# EAGLE design VEML6070-Breakout_v10 (EAGLE 7.5.0)
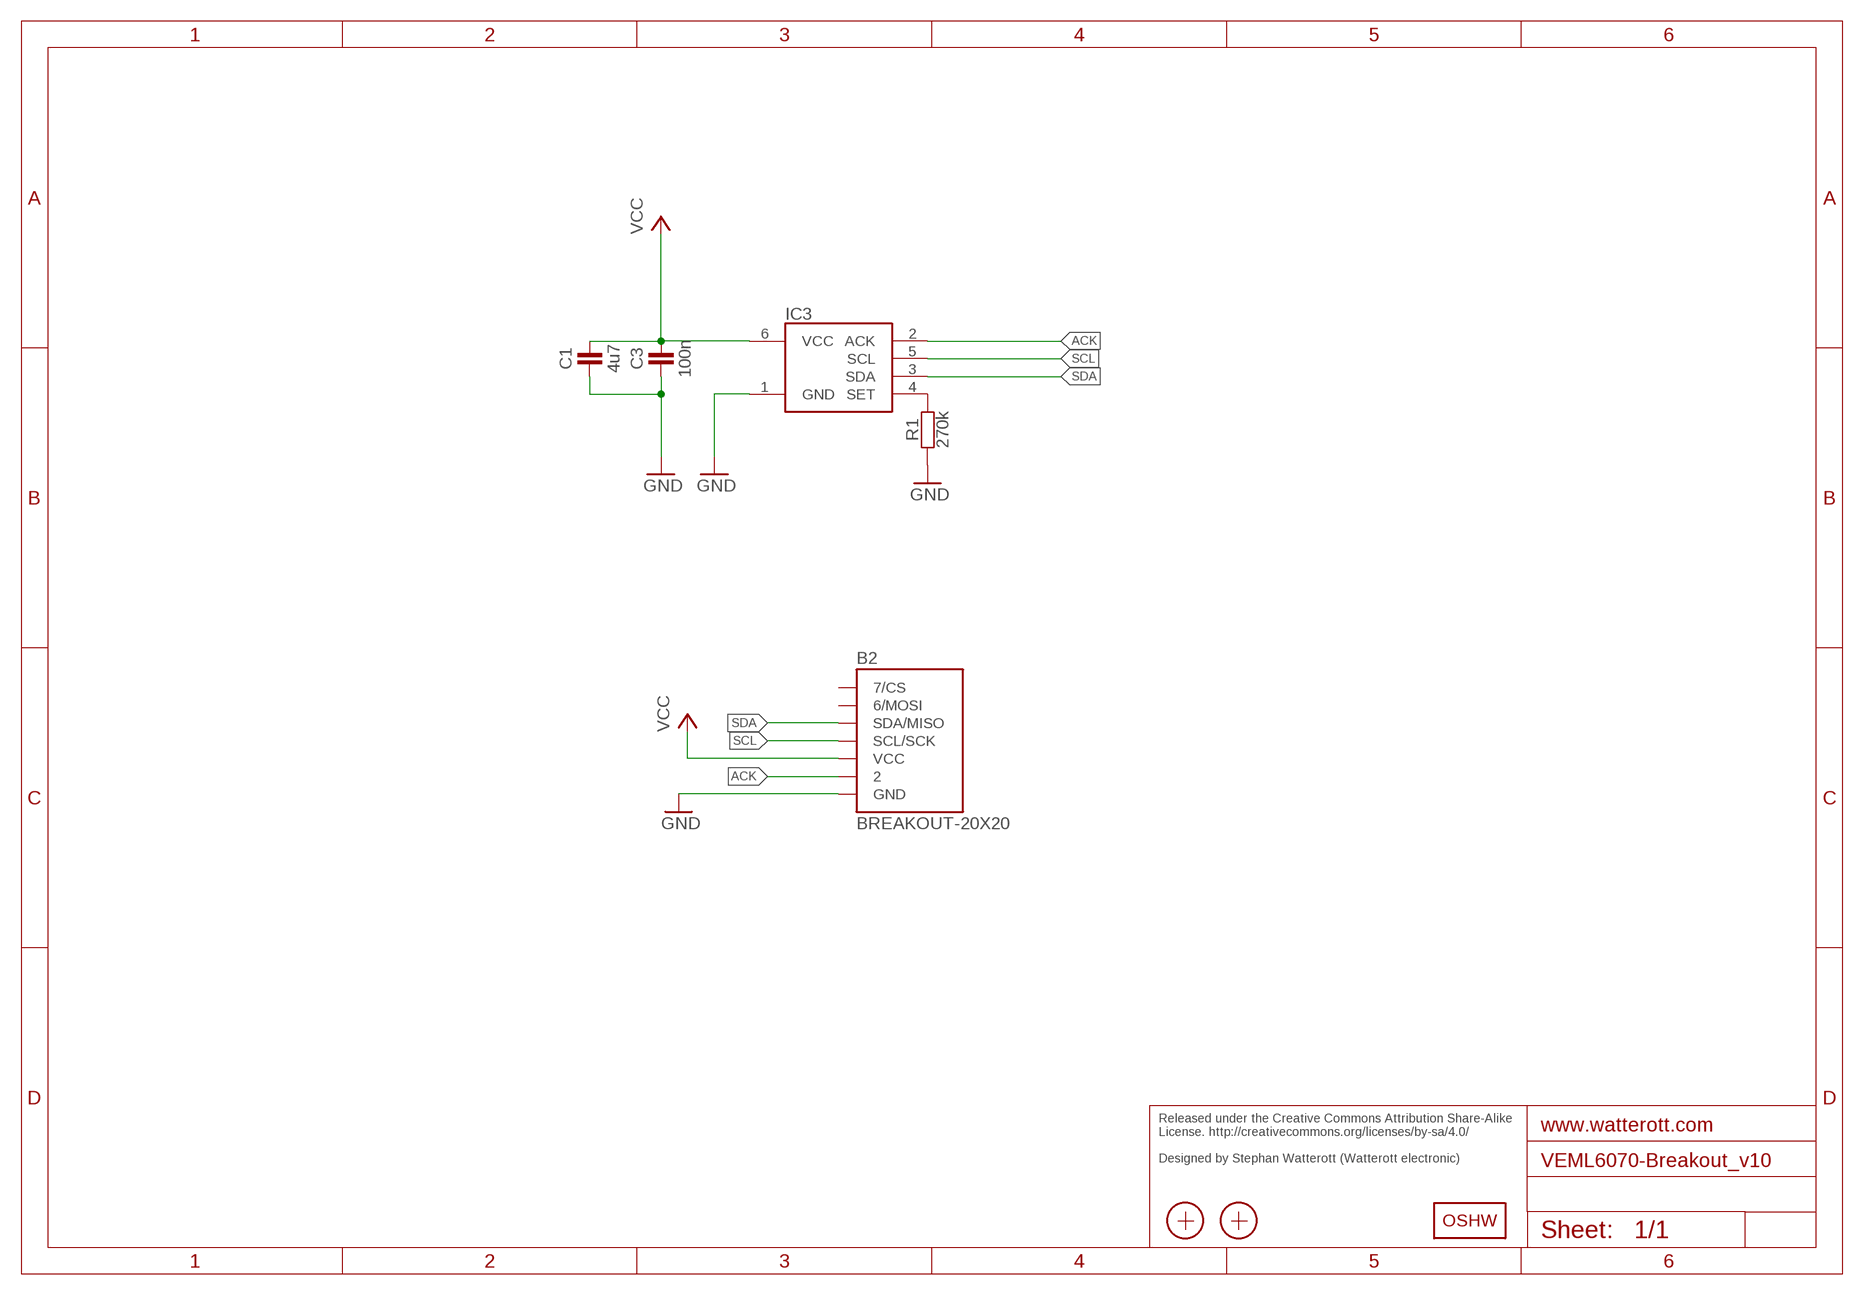
[diagram p0: schematic, sheet 1]

## Parts
B2  BREAKOUT-20X20  [BREAKOUT-20X20]
C1  4u7  CAPACITOR-C0402  [R0402]
C3  100n  CAPACITOR-C0402  [R0402]
IC3  VEML6070  [OPLGA]
LOGO2  OSHW_LOGOX0070  [OSHW_6X70]
R1  270k  RESISTOR-R0402  [R0402]
X1  PASSER-07  [PASSER_07MM]
X2  PASSER-07  [PASSER_07MM]

## Nets
ACK: B2.2 IC3.2(ACK)
GND: B2.GND C1.1 C3.1 IC3.1(GND) R1.1
N$1: IC3.4(SET) R1.2
SCL: B2.SCL/SCK IC3.5(SCL)
SDA: B2.SDA/MISO IC3.3(SDA)
VCC: B2.VCC C1.2 C3.2 IC3.6(VCC)
Unconnected: B2.CS(7/CS) B2.MOSI(6/MOSI)

## Notes on the sheet
- Released under the Creative Commons Attribution Share-Alike 
  License. http://creativecommons.org/licenses/by-sa/4.0/
  
  Designed by Stephan Watterott (Watterott electronic)

## Library data of the parts
B2 = we-board:BREAKOUT: Breakout Template
C1 C3 = we-rcl:CAPACITOR: Capacitors ...4.7uF @ 6.3V -> 0402 ...10uF @ 16V -> 0603 ...22uF @ 25V -> 0805
IC3 = we-sensor:VEML6070: UV Light Sensor with I2C Interface - VEML6070 is an advanced ultraviolet (UV) light sensor with I2C protocol interface and designed by the CMOS process.
LOGO2 = we-symbol:OSHW_LOGO: Open-Source-Hardware Logo
R1 = we-rcl:RESISTOR: Resistors all kinds in 0603 and 0402
X1 X2 = we-symbol:PASSER: Fiducial Markers

## Board
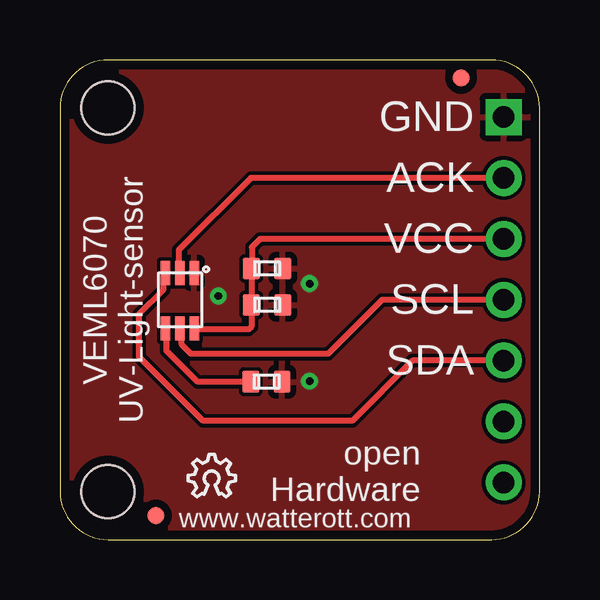
[diagram p1: board, top side]
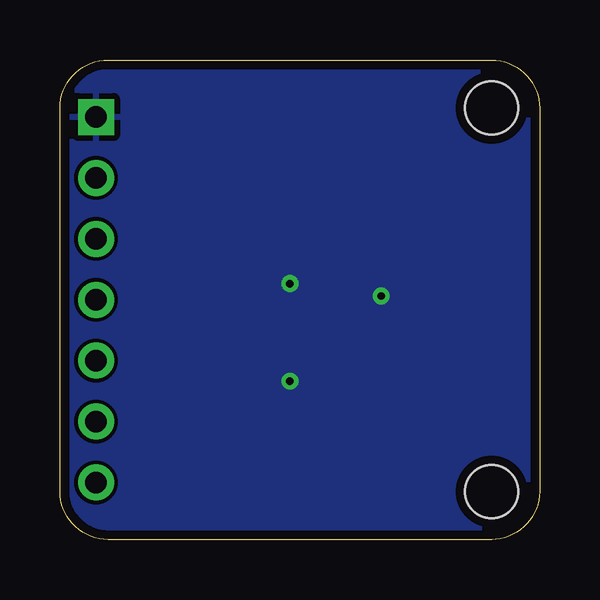
[diagram p2: board, bottom side, seen from below]

Size 20 x 20 mm. Coordinates in mm from the lower left corner, seen from the top.
Copper layers (1*16): Top 0.035mm / dielectric 1.5mm / Bottom 0.035mm
Design rules "default *": minimum track width 6mil, minimum drill 0.296mm, track to track 6mil, track to pad 6mil, pad to pad 6mil, via to via 6mil, smd to smd 1mil, copper to edge 15mil, drill to drill 8mil, minimum pad ring 10mil, minimum via ring 8mil, stop-mask expansion 4mil, vias tented up to drill 0.7mm, thermal gap 10mil

### Footprints (pad centres in the part's own frame; a part is rotated, then mirrored left to right if it is on the bottom)
BREAKOUT-20X20 = drill 0.9 pad 1.5: 2 18.5,15.08; CS 18.5,2.38; MOSI 18.5,4.92; SCL/SCK 18.5,10; SDA/MISO 18.5,7.46; VCC 18.5,12.54 | drill 0.9 pad 1.5 square: GND 18.5,17.62 | hole 2.2: 2,18; 2,2
R0402 = smd 0.9 x 0.7: 1 0,0.65; 2 0,-0.65
OPLGA = smd 1 x 0.4: 1 -1.12,0.6; 2 -1.12,0; 3 -1.12,-0.6; 4 1.2,-0.6; 5 1.2,0; 6 1.2,0.6
PASSER_07MM = smd 0.7 x 0.7: X 0,0

### Placement (x,y rotation side)
B2  0,0 0 top
C1  8.64,9.78 270 top
C3  8.64,11.3 270 top
IC3  5,10 270 top
LOGO2  5.33,1.78 0 top
R1  8.61,6.58 270 top
X1  16.73,19.25 0 top
X2  4,1 0 top

### Tracks (layer width: path | path; a pad name or v marks a point on that pad's centre or on a via)
ACK
  Top 0.254: B2.2 7.97,15.08 4.95,12.06 4.95,11.17 IC3.2
GND  (via drill 0.3)
  other vias: 6.6,10.16 10.41,10.67 10.41,6.6
  pour Top: 0,20 20,20 20,0 0,0
  pour Bottom: 0,20 20,20 20,0 0,0
N$1
  Top 0.254: R1.2 5.74,6.58 4.45,7.87 4.45,8.76 IC3.4
SCL
  Top 0.254: B2.SCL/SCK 13.43,10 11.18,7.75 5.46,7.75 5.08,8.13 5.08,8.72 IC3.5
SDA
  Top 0.254: B2.SDA/MISO 14.7,7.46 12.19,4.95 5.97,4.95 3.3,7.62 3.3,9.4 4.32,10.41 4.32,11.04 IC3.3
VCC
  Top 0.254: IC3.6 5.64,8.76 7.87,8.76 7.99,8.88 C1.2 C3.2 8,11.32 8,12.19 8.35,12.54 B2.VCC

### Text on the board
tPlace: GND | ACK | VCC | VEML6070 / UV-Light-sensor | SCL | SDA | open / Hardware | www.watterott.com